# Altium project ETR_CELLMETER_SLAVE.PrjPcb (part 3 of 3)

## Sheet Charge.SchDoc
size A4
Used 2 times, as channels CH2, CH1. Parts and nets are listed once, with the designators drawn on the sheet.
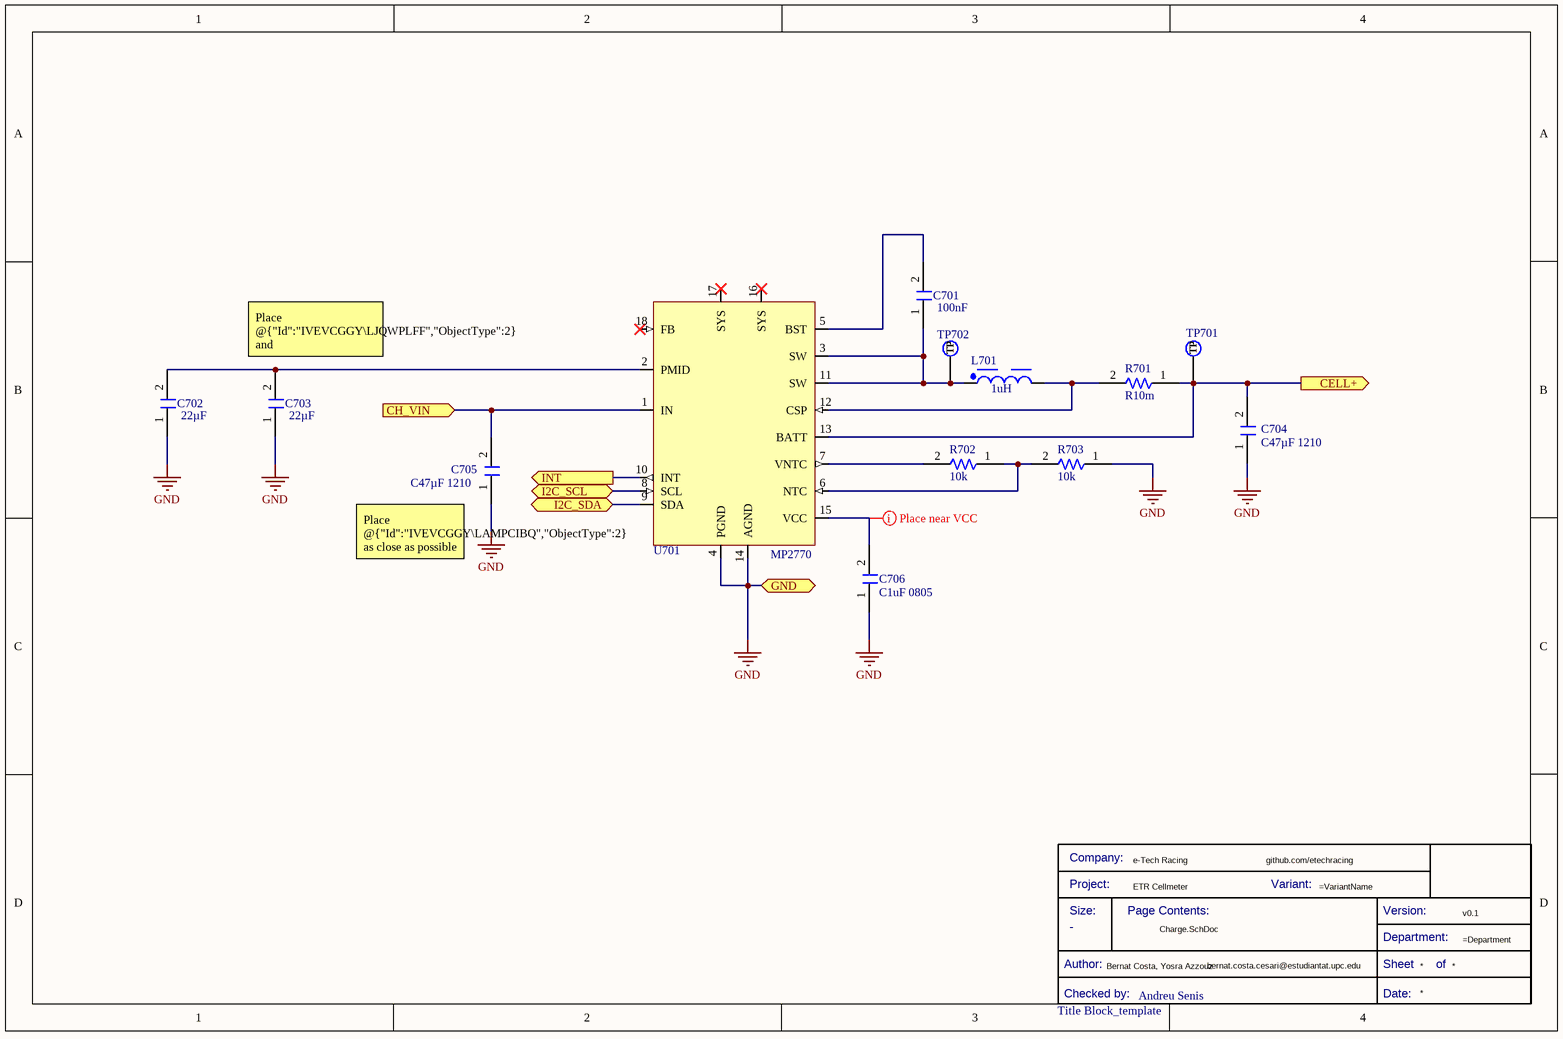
[diagram p8: Charge.SchDoc]

### Parts
*  Title Block_template  Checked by:: Andreu Senis  (graphical)
C701  value 100nF  [CAPC1608X92X38LL15T08]  (hidden comment: C100nF-25V-0603)
C702  value 22µF  [WCAP-CSGP_0805_L2W1.25H0.8_Reflow]  (hidden comment: C22uF-25V-0805)
C703  value 22µF  [WCAP-CSGP_0805_L2W1.25H0.8_Reflow]  (hidden comment: C22uF-25V-0805)
C704  C47µF 1210  [FP-GRM32E-0_3-0_2-IPC_C]
C705  C47µF 1210  [FP-GRM32E-0_3-0_2-IPC_C]
C706  C1uF 0805  [WCAP-CSGP_0805_L2W1.25H1.25]
L701  value 1uH  [WE-PD_7345]  (hidden comment: L1uH_120V_8A)
R701  value R10m  [WRIS-RSKS_1206_Wave]  (hidden comment: R10m-1206)
R702  value 10k  [R0805FTK]  (hidden comment: R10k-0805FTK)
R703  value 10k  [R0805FTK]  (hidden comment: R10k-0805FTK)
TP701  TestPoint  [TestPoint]  (value not drawn)  (no BOM)
TP702  TestPoint  [TestPoint]  (value not drawn)  (no BOM)
U701  MP2770  [MP2770]

### Ports
CELL+ (out), CH_VIN (in), GND (bidir), I2C_SCL (bidir), I2C_SDA (bidir), INT (out)

### Nets
GND: C702.1 C703.1 C704.1 C705.1 C706.1 R703.1 U701.4(PGND) U701.14(AGND) ; port GND
CELL+: C704.2 R701.1 TP701.1(TP) U701.13(BATT) ; port CELL+
CH_VIN: C705.2 U701.1(IN) ; port CH_VIN
I2C_SCL: U701.8(SCL) ; port I2C_SCL
I2C_SDA: U701.9(SDA) ; port I2C_SDA
INT: U701.10(INT) ; port INT
NetC701_1: C701.1 L701.1 TP702.1(TP) U701.3(SW) U701.11(SW)
NetC701_2: C701.2 U701.5(BST)
NetC702_2: C702.2 C703.2 U701.2(PMID)
NetC706_2: C706.2 U701.15(VCC)
NetL701_2: L701.2 R701.2 U701.12(CSP)
NetR702_1: R702.1 R703.2 U701.6(NTC)
NetR702_2: R702.2 U701.7(VNTC)

Not connected (* = marked no-connect by the designer): U701 16(SYS)* 17(SYS)* 18(FB)*

### Channels
CH2: designators end in _CH2; ports CELL+=NetC704_CH2_2 CH_VIN=+12V GND=GND I2C_SCL=I2C2_SCL I2C_SDA=I2C2_SDA INT=CH2_INT
CH1: designators end in _CH1; ports CELL+=NetC704_CH1_2 CH_VIN=+12V GND=GND I2C_SCL=I2C1_SCL I2C_SDA=I2C1_SDA INT=CH1_INT

### Layout directives
mark named Place near VCC: NetC706_CH2_2

### Notes on the sheet
- (near C703) Place @{"Id":"IVEVCGGY\LJQWPLFF","ObjectType":2} and @{"Id":"IVEVCGGY\PTQDCIFI","ObjectType":2} as close as possible to the IC
- (near C705) Place @{"Id":"IVEVCGGY\LAMPCIBQ","ObjectType":2} as close as possible to the IC
- (in symbol CMP-00043-7) Company:; Project:; Variant:; Size:; Page Contents:; Version:; Department:; Author:; Sheet; of; Checked by:; Date:

### Library data of the parts
* = CMP-00043-7: Standard Title Block; .Creator: GP; Size: -; Design Item ID: Title Block_template; Category: Title Block; .SCHcheck: GP; Source: e-Tech_Racing.SchLib; .PCBcheck: GP
C701 = CMP-001-00026-1: Ceramic Capacitor, Multilayer, Ceramic, 25V, 5% +Tol, 5% -Tol, X7R, 15% TC, 0.1uF, Surface Mount, 0603. PN: VJ0603Y104JXXAC.; Capacitor Type: Ceramic; RoHS Compliant: Yes; Pins: 2; Max Operating Temperature: 125°C; Min Operating Temperature: -55°C; Case/Package: 0603; Mounting Technology: Surface Mount
C702 C703 = CMP-001-00029-1: Ceramic Capacitor, Multilayer, Ceramic, 25V, 20% +Tol, 20% -Tol, X5R, 15% TC, 22uF, Surface Mount, 0805. PN: C2012X5R1E226M125AC.; Case/Package: 0805; Mounting Technology: Surface Mount; Min Operating Temperature: -55°C; Capacitor Type: Ceramic; Pins: 2; RoHS Compliant: Yes; Max Operating Temperature: 85°C
C704 C705 = CMP-001-00003-4: Ceramic Capacitor, Multilayer, Ceramic, 10V, 10% +Tol, 10% -Tol, X6S, 22% TC, 47uF, Surface Mount, 1210; Value: 47µF; Capacitor Type: Ceramic; Min Operating Temperature: -55°C; Pins: 2; RoHS Compliant: Yes; Case/Package: 1210; Max Operating Temperature: 105°C; Mounting Technology: Surface Mount
C706 = CMP-001-00010-5: Ceramic Capacitor, Multilayer, Ceramic, 16V, 10% +Tol, 10% -Tol, X7R, 15% TC, 1uF, Surface Mount, 0805; Capacitor Type: Ceramic; Pins: 2; RoHS Compliant: Yes
L701 = CMP-006-00008-1: General Purpose Inductor, 1uH, 40%, 1 Element, Ferrite-Core, SMD, 2929. PN: 744777001; Max Current Rating: 8A; Self Resonant Frequency: 90MHz; Tolerance: 40%; Max Operating Temperature: 125°C; Min Operating Temperature: -40°C; RoHS Compliant: Yes; Pins: 2
R701 = CMP-009-00047-1: Fixed Resistor, Metal Strip, 0.25W, 0.01ohm, 0.05V, 1% +/-Tol, 75ppm/Cel, Surface Mount, 1206. PN: WSL1206R0100FEK; Power: 250mW; Pins: 2; Case/Package: 1206; RoHS Compliant: Yes; Min Operating Temperature: -65°C; Tolerance: 1%; Max Operating Temperature: 170°C; Mounting Technology: Surface Mount
R702 R703 = CMP-00085-4: BOURNS         CR0805-JW-103ELF            Surface Mount Chip Resistor, Thick Film, CR Series, 10 kohm, 125 mW,  5%, 150 V; Voltage Rating: 150V; Voltage Rating (DC): 100V; Max Power Dissipation: 125mW; Temperature Coefficient: 200ppm/°C; .Creator: DR; Depth: 1.25mm; Package Quantity: 1; ComponentLink6Description: https://datasheet.ciiva.com/16783/70154685-16783482.pdf?src-supplier=Allied+Electronics; Max Operating Temperature: 155°C; ComponentLink8Description: https://datasheet.ciiva.com/6559/chpreztr-6559900.pdf?src-supplier=Digi-Key; ComponentLink3URL: https://datasheet.ciiva.com/22693/1902866-22693254.pdf?src-supplier=Element14; ComponentLink2URL: https://datasheet.ciiva.com/9122/chpreztr-9122374.pdf?src-supplier=Avnet; REACH SVHC: No SVHC; ComponentLink9Description: https://datasheet.ciiva.com/6559/chpreztr-6559901.pdf?src-supplier=Digi-Key; ComponentLink1URL: https://datasheet.ciiva.com/11821/0900766b80fcdb72-11821135.pdf?src-supplier=RSComponents; Manufacturer Part Number 1: CR0805-JW-103ELF; ComponentLink8URL: https://datasheet.ciiva.com/6559/chpreztr-6559900.pdf?src-supplier=Digi-Key; Length: 2mm; ComponentLink10Description: https://datasheet.ciiva.com/7985/1856384-7985869.pdf?src-supplier=Element14; Case/Package: 0805; ComponentLink5Description: https://datasheet.ciiva.com/30065/159chpreztr-30065976.pdf?src-supplier=Onlinecomponents.com; Design Item ID: R10k-0805FTK; ComponentLink1Description: https://datasheet.ciiva.com/11821/0900766b80fcdb72-11821135.pdf?src-supplier=RSComponents; Number of Terminations: 2; Radiation Hardening: No; Resistance Tolerance: 5%; ComponentLink4Description: https://datasheet.ciiva.com/7986/691949-7986187.pdf?src-supplier=Element14; ComponentLink3Description: https://datasheet.ciiva.com/22693/1902866-22693254.pdf?src-supplier=Element14; Packaging: Tape and Reel; ComponentLink6URL: https://datasheet.ciiva.com/16783/70154685-16783482.pdf?src-supplier=Allied+Electronics; Pins: 2; ComponentLink5URL: https://datasheet.ciiva.com/30065/159chpreztr-30065976.pdf?src-supplier=Onlinecomponents.com; Mount: Surface Mount; ComponentLink11URL: https://datasheet.ciiva.com/48692/001055517-da-01-en-smd-wid-cr0805-jw-103elf-10k-ohm-1-8w-48692118.pdf?src-supplier=Conrad; ComponentLink11Description: https://datasheet.ciiva.com/48692/001055517-da-01-en-smd-wid-cr0805-jw-103elf-10k-ohm-1-8w-48692118.pdf?src-supplier=Conrad; Military Standard: Not; Power Rating: 125mW; Thickness: 508um; Source: Passives.SchLib; Min Operating Temperature: -55°C; Manufacturer 1: Bourns; Resistor Type: Thick Film; ComponentLink7URL: https://datasheet.ciiva.com/5548/chpreztr-5548491.pdf?src-supplier=Mouser; ComponentLink2Description: https://datasheet.ciiva.com/9122/chpreztr-9122374.pdf?src-supplier=Avnet; Termination: SMD/SMT; Features: Moisture Resistant; ComponentLink4URL: https://datasheet.ciiva.com/7986/691949-7986187.pdf?src-supplier=Element14; RoHS Compliant: Yes; ComponentLink9URL: https://datasheet.ciiva.com/6559/chpreztr-6559901.pdf?src-supplier=Digi-Key; Technology: THICK FILM; ComponentLink10URL: https://datasheet.ciiva.com/7985/1856384-7985869.pdf?src-supplier=Element14; Height: 0.5mm; Category: Chip SMD Resistors; RoHS: Yes; Series: CR0805; Pricing 1: 1=0,05790, 10=0,01540, 25=0,01340, 100=0,00340 (USD); Stock 1: 57566; ComponentLink7Description: https://datasheet.ciiva.com/5548/chpreztr-5548491.pdf?src-supplier=Mouser; Case Code (Metric): 2012; Contact Plating: Tin; Tolerance: 5%; Construction: Rectangular; Width: 1.25mm
TP701 TP702 = CMP-00042-1: Test Point 1x1 mm; .SCHcheck: GP; Category: TestPoint; Source: e-Tech_Racing.SchLib; .Creator: GP; .PCBcheck: GP; Design Item ID: TestPoint
U701 = CMP-00029-00002-7: 6A, 1-Cell Switching Charger with Power Path Management and 3.65A Boost Output; ComponentLink1Description: Datasheet; ComponentLink1URL: https://www.monolithicpower.com/en/documentview/productdocument/index/version/2/document_type/Datasheet/lang/en/sku/MP2770GL/document_id/10545/

## Sheet NTC.SchDoc
size A4
Used 4 times, as channels NTC1, NTC2, NTC4, NTC3. Parts and nets are listed once, with the designators drawn on the sheet.
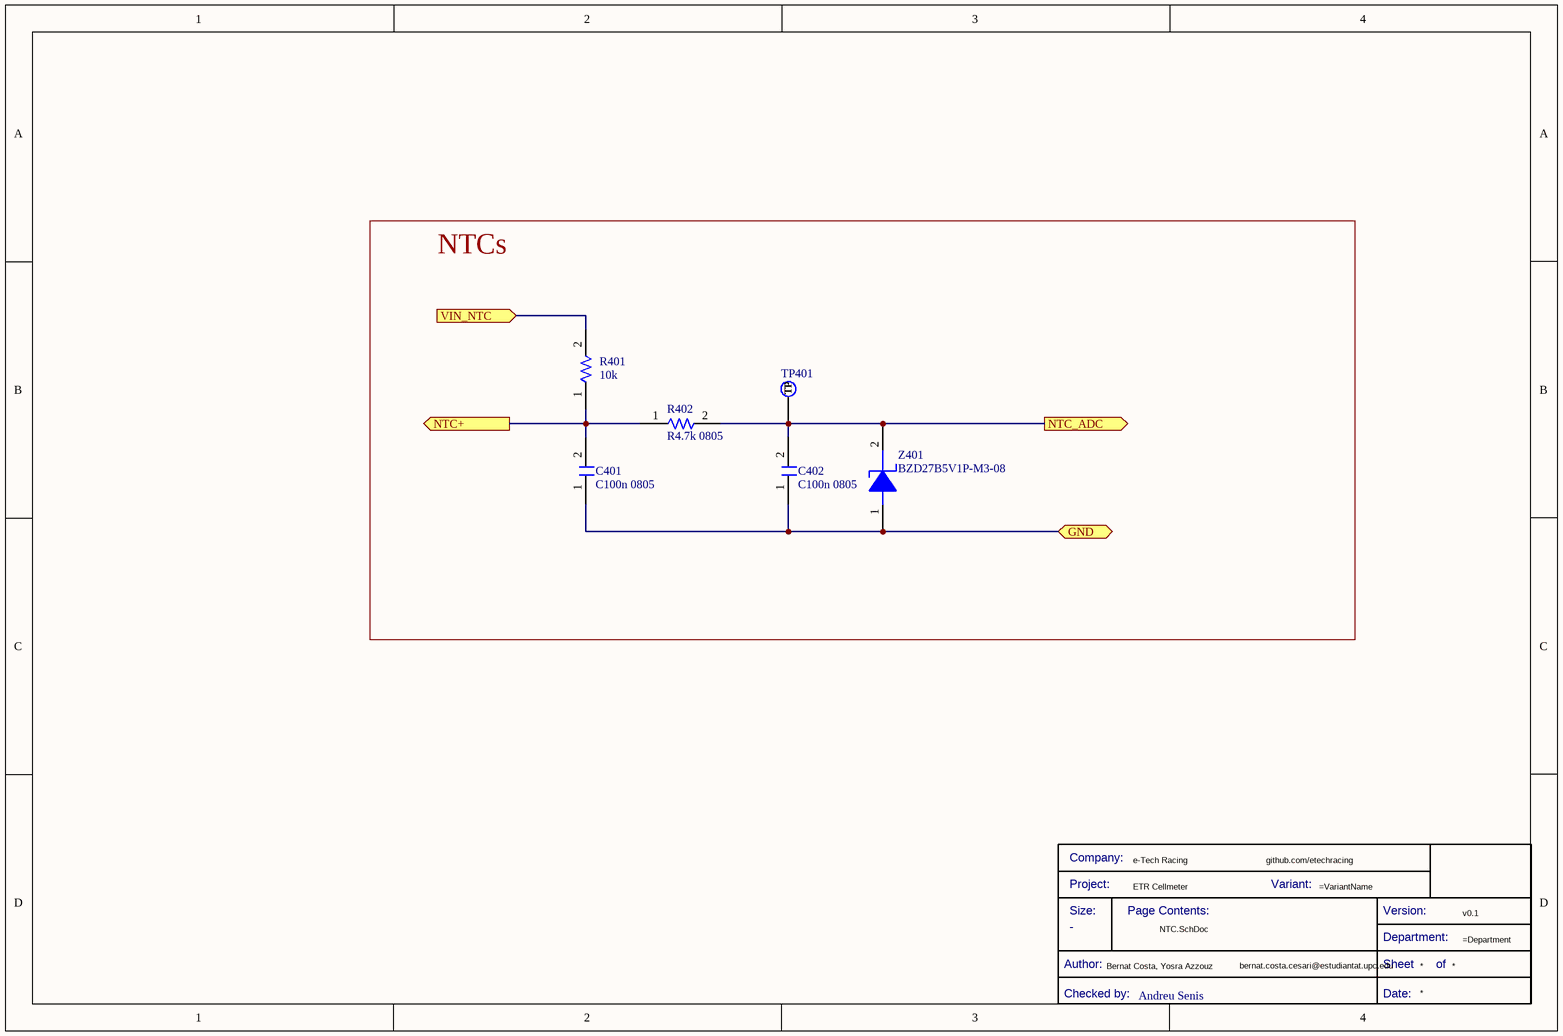
[diagram p9: NTC.SchDoc]

### Parts
*  Checked by:: Andreu Senis  (hidden comment: Title Block_template)  (graphical)
C401  C100n 0805  [C0805FNPC-R]
C402  C100n 0805  [C0805FNPC-R]
R401  value 10k  [R0805FTK]  (hidden comment: R10k-0805FTK)
R402  R4.7k 0805  [R0805FTK]
TP401  TestPoint  [TestPoint]  (value not drawn)  (no BOM)
Z401  BZD27B5V1P-M3-08  [SODFL370X108-2N]

### Blocks framed on the sheet
NTCs: C401 C402 R401 R402 TP401 Z401

### Ports
GND (bidir), NTC+ (out), NTC_ADC (out), VIN_NTC (in)

### Nets
GND: C401.1 C402.1 Z401.1 ; port GND
NTC+: C401.2 R401.1 R402.1 ; port NTC+
NTC_ADC: C402.2 R402.2 TP401.1(TP) Z401.2 ; port NTC_ADC
VIN_NTC: R401.2 ; port VIN_NTC

### Channels
NTC1: designators end in _NTC1; ports GND=GND NTC+=NTC2+ NTC_ADC=NetC402_NTC1_2 VIN_NTC=+5V
NTC2: designators end in _NTC2; ports GND=GND NTC+=NTC1+ NTC_ADC=NetC402_NTC2_2 VIN_NTC=+5V
NTC4: designators end in _NTC4; ports GND=GND NTC+=NetC401_NTC4_2 NTC_ADC=DCH_NTC2_ADC VIN_NTC=+5V
NTC3: designators end in _NTC3; ports GND=GND NTC+=NetC401_NTC3_2 NTC_ADC=DCH_NTC1_ADC VIN_NTC=+5V

### Notes on the sheet
- (in symbol Title Block_template) Company:; Project:; Variant:; Size:; Page Contents:; Version:; Department:; Author:; Sheet; of; Checked by:; Date:

### Library data of the parts
* = Title Block_template: Standard Title Block; .Creator: GP; Category: Title Block; .PCBcheck: GP; .SCHcheck: GP; Size: -
C401 C402 = CMP-00063-3: Cap, 0.1ΜF, 50V, 10%, X7R, 0805; Manufacturer Part Number 1: 885012207098; Manufacturer 1: Wurth Electronics; Value: 100nF; .Creator: DR; ComponentLink2Description: http://www.farnell.com/datasheets/1958498.pdf?src-supplier=Element14; ComponentLink1Description: http://www.farnell.com/datasheets/1958498.pdf?src-supplier=Farnell; Thickness: 0.035inch; ComponentLink1URL: http://www.farnell.com/datasheets/1958498.pdf?src-supplier=Farnell; Min Operating Temperature: -55°C; Packaging: Cut Tape; ComponentLink2URL: http://www.farnell.com/datasheets/1958498.pdf?src-supplier=Element14; Mount: Surface Mount; Voltage Rating (DC): 50V; Tolerance: 10%; Category: Ceramic Capacitors; RoHS: Yes; Width: 0.049inch; Pricing 1: 100=0,10200, 500=0,07100, 2000=0,06100 (GBP); RoHS Compliant: Yes; ComponentLink4Description: http://www.farnell.com/datasheets/1958498.pdf?src-supplier=Newark; Dielectric: X7R; Stock 1: 8000; Length: 0.079inch; ComponentLink3URL: https://katalog.we-online.de/pbs/datasheet/885012207098.pdf?src-supplier=Digi-Key; ComponentLink3Description: https://katalog.we-online.de/pbs/datasheet/885012207098.pdf?src-supplier=Digi-Key; Design Item ID: C100n-50V-0805FNPC-X7R; ComponentLink4URL: http://www.farnell.com/datasheets/1958498.pdf?src-supplier=Newark; REACH SVHC: Unknown; Case Code (Metric): 2012; Voltage Rating: 50V; Max Operating Temperature: 125°C; Source: Passives.SchLib; Case/Package: 0805
R401 = CMP-00085-3: BOURNS         CR0805-JW-103ELF            Surface Mount Chip Resistor, Thick Film, CR Series, 10 kohm, 125 mW,  5%, 150 V; Voltage Rating: 150V; Max Power Dissipation: 125mW; .Creator: DR; Temperature Coefficient: 200ppm/°C; Voltage Rating (DC): 100V; ComponentLink8Description: https://datasheet.ciiva.com/6559/chpreztr-6559900.pdf?src-supplier=Digi-Key; Depth: 1.25mm; ComponentLink4URL: https://datasheet.ciiva.com/7986/691949-7986187.pdf?src-supplier=Element14; RoHS Compliant: Yes; ComponentLink5Description: https://datasheet.ciiva.com/30065/159chpreztr-30065976.pdf?src-supplier=Onlinecomponents.com; Height: 0.5mm; ComponentLink9URL: https://datasheet.ciiva.com/6559/chpreztr-6559901.pdf?src-supplier=Digi-Key; REACH SVHC: No SVHC; ComponentLink2Description: https://datasheet.ciiva.com/9122/chpreztr-9122374.pdf?src-supplier=Avnet; ComponentLink1URL: https://datasheet.ciiva.com/11821/0900766b80fcdb72-11821135.pdf?src-supplier=RSComponents; ComponentLink7Description: https://datasheet.ciiva.com/5548/chpreztr-5548491.pdf?src-supplier=Mouser; Termination: SMD/SMT; RoHS: Yes; Length: 2mm; Pins: 2; Radiation Hardening: No; Thickness: 508um; Width: 1.25mm; Pricing 1: 1=0,05790, 10=0,01540, 25=0,01340, 100=0,00340 (USD); Resistor Type: Thick Film; Stock 1: 57566; Package Quantity: 1; ComponentLink4Description: https://datasheet.ciiva.com/7986/691949-7986187.pdf?src-supplier=Element14; ComponentLink5URL: https://datasheet.ciiva.com/30065/159chpreztr-30065976.pdf?src-supplier=Onlinecomponents.com; Mount: Surface Mount; Resistance Tolerance: 5%; Tolerance: 5%; Construction: Rectangular; ComponentLink11Description: https://datasheet.ciiva.com/48692/001055517-da-01-en-smd-wid-cr0805-jw-103elf-10k-ohm-1-8w-48692118.pdf?src-supplier=Conrad; ComponentLink6Description: https://datasheet.ciiva.com/16783/70154685-16783482.pdf?src-supplier=Allied+Electronics; ComponentLink10URL: https://datasheet.ciiva.com/7985/1856384-7985869.pdf?src-supplier=Element14; Case Code (Metric): 2012; Technology: THICK FILM; ComponentLink3Description: https://datasheet.ciiva.com/22693/1902866-22693254.pdf?src-supplier=Element14; Min Operating Temperature: -55°C; Manufacturer 1: Bourns; ComponentLink2URL: https://datasheet.ciiva.com/9122/chpreztr-9122374.pdf?src-supplier=Avnet; Military Standard: Not; Features: Moisture Resistant; ComponentLink7URL: https://datasheet.ciiva.com/5548/chpreztr-5548491.pdf?src-supplier=Mouser; Design Item ID: R10k-0805FTK; ComponentLink9Description: https://datasheet.ciiva.com/6559/chpreztr-6559901.pdf?src-supplier=Digi-Key; Power Rating: 125mW; ComponentLink11URL: https://datasheet.ciiva.com/48692/001055517-da-01-en-smd-wid-cr0805-jw-103elf-10k-ohm-1-8w-48692118.pdf?src-supplier=Conrad; ComponentLink8URL: https://datasheet.ciiva.com/6559/chpreztr-6559900.pdf?src-supplier=Digi-Key; Contact Plating: Tin; ComponentLink10Description: https://datasheet.ciiva.com/7985/1856384-7985869.pdf?src-supplier=Element14; Manufacturer Part Number 1: CR0805-JW-103ELF; Packaging: Tape and Reel; ComponentLink3URL: https://datasheet.ciiva.com/22693/1902866-22693254.pdf?src-supplier=Element14; ComponentLink6URL: https://datasheet.ciiva.com/16783/70154685-16783482.pdf?src-supplier=Allied+Electronics; ComponentLink1Description: https://datasheet.ciiva.com/11821/0900766b80fcdb72-11821135.pdf?src-supplier=RSComponents; Series: CR0805; Category: Chip SMD Resistors; Number of Terminations: 2; Max Operating Temperature: 155°C; Source: Passives.SchLib; Case/Package: 0805
R402 = CMP-00102-2: Res Thick Film 0805 4.7K Ohm 5% 1/8W ±200ppm/°C Molded SMD SMD Paper Tape on Plastic Reel; Manufacturer 1: Bourns; Manufacturer Part Number 1: CR0805-JW-472ELF; .Creator: DR; Voltage Rating: 150V; Power Rating: 125mW; ComponentLink5URL: https://datasheet.ciiva.com/9122/chpreztr-9122814.pdf?src-supplier=Avnet; Package Quantity: 1; Min Operating Temperature: -55°C; ComponentLink5Description: https://datasheet.ciiva.com/9122/chpreztr-9122814.pdf?src-supplier=Avnet; Case Code (Metric): 2012; Termination: SMD/SMT; Series: CR0805; Packaging: Tape and Reel; Value: 4.7k; ComponentLink3URL: https://datasheet.ciiva.com/6560/chpreztr-6560074.pdf?src-supplier=Digi-Key; Height: 0.024inch; Case/Package: 0805; Military Standard: Not; Depth: 1.25mm; Thickness: 508um; Contact Plating: Tin; Features: Moisture Resistant; Temperature Coefficient: 200ppm/°C; ComponentLink4URL: https://datasheet.ciiva.com/30174/159chpreztr-30174252.pdf?src-supplier=Onlinecomponents.com; RoHS: Yes; Stock 1: 3734; ComponentLink1URL: https://datasheet.ciiva.com/5541/chpreztr-5541593.pdf?src-supplier=Mouser; Design Item ID: R4.7K-0805FTK; ComponentLink7URL: https://datasheet.ciiva.com/6560/chpreztr-6560075.pdf?src-supplier=Digi-Key; Category: Chip SMD Resistors; Resistance Tolerance: 5%; Width: 0.049inch; ComponentLink2Description: https://datasheet.ciiva.com/6560/chpreztr-6560073.pdf?src-supplier=Digi-Key; Mount: Surface Mount; Pricing 1: 1=0,05590, 10=0,01670, 25=0,01290, 100=0,00840, 250=0,00830, 500=0,00690, 1000=0,00410 (USD); Resistor Type: Thick Film; REACH SVHC: No SVHC; Source: Passives.SchLib; ComponentLink2URL: https://datasheet.ciiva.com/6560/chpreztr-6560073.pdf?src-supplier=Digi-Key; Construction: Rectangular; Length: 2mm; ComponentLink7Description: https://datasheet.ciiva.com/6560/chpreztr-6560075.pdf?src-supplier=Digi-Key; Radiation Hardening: No; ComponentLink3Description: https://datasheet.ciiva.com/6560/chpreztr-6560074.pdf?src-supplier=Digi-Key; ComponentLink4Description: https://datasheet.ciiva.com/30174/159chpreztr-30174252.pdf?src-supplier=Onlinecomponents.com; ComponentLink1Description: https://datasheet.ciiva.com/5541/chpreztr-5541593.pdf?src-supplier=Mouser; ComponentLink6URL: https://datasheet.ciiva.com/22713/691949-22713272.pdf?src-supplier=Element14; RoHS Compliant: Yes; Max Operating Temperature: 155°C; Voltage Rating (DC): 150V; Tolerance: 5%; Number of Terminations: 2; Max Power Dissipation: 125mW; ComponentLink6Description: https://datasheet.ciiva.com/22713/691949-22713272.pdf?src-supplier=Element14
TP401 = CMP-00042-1: Test Point 1x1 mm; .SCHcheck: GP; Category: TestPoint; Source: e-Tech_Racing.SchLib; .Creator: GP; .PCBcheck: GP; Design Item ID: TestPoint
Z401 = CMP-004-00008-1: Zener Diode, 5.1V V(Z), 2%, 0.8W, Silicon, Unidirectional, DO-219AB; RoHS Compliant: Yes; Pins: 2; Max Operating Temperature: 175°C; Min Operating Temperature: -65°C

## Nets that join several sheets
+3.3V: ETR_CELLMETER_SLAVE (J7.1), Level_Shifter (C201.2 U201.1), CAN (C605#1.2 U601#1.5), MCU (13 pins), Supply (5 pins), DCH1 (C801_DCH1.1 R801_DCH1.2 U801_DCH1.8), DCH2 (C801_DCH2.1 R801_DCH2.2 U801_DCH2.8)
+5V: ADC (C105.2 L101.1), Level_Shifter (C202.2 U201.20), CAN (C601#1.2 C602#1.2 U601#1.3), Supply (8 pins), KCELL1 (D301_KCELL1.K D302_KCELL1.K K301_KCELL1.A2 K302_KCELL1.A2), KCELL2 (D301_KCELL2.K D302_KCELL2.K K301_KCELL2.A2 K302_KCELL2.A2), NTC1 (R401_NTC1.2), NTC2 (R401_NTC2.2), NTC4 (R401_NTC4.2), NTC3 (R401_NTC3.2)
+12V: ETR_CELLMETER_SLAVE (J8.1), Supply (7 pins), DCH1 (C803_DCH1.2 U802_DCH1.8), DCH2 (C803_DCH2.2 U802_DCH2.8), CH2 (C705_CH2.2 U701_CH2.1), CH1 (C705_CH1.2 U701_CH1.1)
GND: ETR_CELLMETER_SLAVE (12 pins), ADC (12 pins), Level_Shifter (C201.1 C202.1 U201.10 U201.11), CAN (12 pins), MCU (26 pins), Supply (16 pins), KCELL1 (Q301_KCELL1.S Q302_KCELL1.S R302_KCELL1.1 R304_KCELL1.1), KCELL2 (Q301_KCELL2.S Q302_KCELL2.S R302_KCELL2.1 R304_KCELL2.1), DCH1 (10 pins), DCH2 (10 pins), CH2 (8 pins), CH1 (8 pins), NTC1 (C401_NTC1.1 C402_NTC1.1 Z401_NTC1.1), NTC2 (C401_NTC2.1 C402_NTC2.1 Z401_NTC2.1), NTC4 (C401_NTC4.1 C402_NTC4.1 Z401_NTC4.1), NTC3 (C401_NTC3.1 C402_NTC3.1 Z401_NTC3.1)
CAN1_H: ETR_CELLMETER_SLAVE (J3.1 J3.2), CAN (C604#1.2 D601#1.2 L601#1.2 R601#1.2)
CAN1_L: ETR_CELLMETER_SLAVE (J4.1 J4.2), CAN (C608#1.1 D602#1.1 L601#1.3 R602#1.1)
CELL1+: ETR_CELLMETER_SLAVE (D1.2 J9.1), KCELL1 (K302_KCELL1.11)
CELL1_LED1: ETR_CELLMETER_SLAVE (J1.3), MCU (U601#2.85)
CELL1_LED2: ETR_CELLMETER_SLAVE (J1.4), MCU (U601#2.84)
CELL2+: ETR_CELLMETER_SLAVE (D2.2 J10.1), KCELL2 (K302_KCELL2.11)
CELL2_LED1: ETR_CELLMETER_SLAVE (J2.3), MCU (U601#2.24)
CELL2_LED2: ETR_CELLMETER_SLAVE (J2.4), MCU (U601#2.25)
CH1_INT: MCU (U601#2.81), CH1 (U701_CH1.10)
CH2_INT: MCU (U601#2.7), CH2 (U701_CH2.10)
DAC_OUT1: MCU (U601#2.29), DCH1 (U802_DCH1.5)
DAC_OUT2: MCU (U601#2.30), DCH2 (U802_DCH2.5)
DCH_NTC1_ADC: MCU (U601#2.35), NTC3 (C402_NTC3.2 R402_NTC3.2 TP401_NTC3.1 Z401_NTC3.2)
DCH_NTC2_ADC: MCU (U601#2.36), NTC4 (C402_NTC4.2 R402_NTC4.2 TP401_NTC4.1 Z401_NTC4.2)
I2C1_SCL: MCU (U601#2.92), CH1 (U701_CH1.8)
I2C1_SDA: MCU (U601#2.93), CH1 (U701_CH1.9)
I2C2_SCL: MCU (U601#2.47), CH2 (U701_CH2.8)
I2C2_SDA: MCU (U601#2.48), CH2 (U701_CH2.9)
MCU_ADC_S1: MCU (U601#2.34), DCH1 (U801_DCH1.7)
MCU_ADC_S2: MCU (U601#2.16), DCH2 (U801_DCH2.7)
NetC401_NTC3_2: DCH1 (NTC801_DCH1.1), NTC3 (C401_NTC3.2 R401_NTC3.1 R402_NTC3.1)
NetC401_NTC4_2: DCH2 (NTC801_DCH2.1), NTC4 (C401_NTC4.2 R401_NTC4.1 R402_NTC4.1)
NetC402_NTC1_2: MCU (U601#2.17), NTC1 (C402_NTC1.2 R402_NTC1.2 TP401_NTC1.1 Z401_NTC1.2)
NetC402_NTC2_2: MCU (U601#2.18), NTC2 (C402_NTC2.2 R402_NTC2.2 TP401_NTC2.1 Z401_NTC2.2)
NetC704_CH1_2: KCELL1 (K301_KCELL1.12), CH1 (C704_CH1.2 R701_CH1.1 TP701_CH1.1 U701_CH1.13)
NetC704_CH2_2: KCELL2 (K301_KCELL2.12), CH2 (C704_CH2.2 R701_CH2.1 TP701_CH2.1 U701_CH2.13)
NetK301_KCELL1_14: KCELL1 (K301_KCELL1.14), DCH1 (U801_DCH1.1 U801_DCH1.2)
NetK301_KCELL2_14: KCELL2 (K301_KCELL2.14), DCH2 (U801_DCH2.1 U801_DCH2.2)
NetR301_KCELL1_1: MCU (U601#2.60), KCELL1 (R301_KCELL1.1 R302_KCELL1.2)
NetR301_KCELL2_1: MCU (U601#2.2), KCELL2 (R301_KCELL2.1 R302_KCELL2.2)
NetR303_KCELL1_1: MCU (U601#2.59), KCELL1 (R303_KCELL1.1 R304_KCELL1.2)
NetR303_KCELL2_1: MCU (U601#2.3), KCELL2 (R303_KCELL2.1 R304_KCELL2.2)
NetU101_8: ADC (U101.8), Level_Shifter (U201.5)
NetU101_9: ADC (U101.9), Level_Shifter (U201.3)
NetU101_10: ADC (U101.10), Level_Shifter (U201.19)
NetU101_11: ADC (U101.11), Level_Shifter (U201.15)
NetU201_2: Level_Shifter (U201.2), MCU (U601#2.90)
NetU201_6: Level_Shifter (U201.6), MCU (U601#2.89)
NetU201_16: Level_Shifter (U201.16), MCU (U601#2.77)
NetU201_18: Level_Shifter (U201.18), MCU (U601#2.91)
NetU601#1_1: CAN (U601#1.1), MCU (U601#2.70)
NetU601#1_4: CAN (U601#1.4), MCU (U601#2.71)
NRST: ETR_CELLMETER_SLAVE (J7.5), MCU (U601#2.14)
NTC1+: ETR_CELLMETER_SLAVE (J1.1), NTC2 (C401_NTC2.2 R401_NTC2.1 R402_NTC2.1)
NTC2+: ETR_CELLMETER_SLAVE (J2.1), NTC1 (C401_NTC1.2 R401_NTC1.1 R402_NTC1.1)
S_CELL1+: ETR_CELLMETER_SLAVE (J5.2), ADC (R101.2)
S_CELL1-: ETR_CELLMETER_SLAVE (J5.1), ADC (R102.2)
S_CELL2+: ETR_CELLMETER_SLAVE (J6.2), ADC (R103.2)
S_CELL2-: ETR_CELLMETER_SLAVE (J6.1), ADC (R104.2)
SWCLK: ETR_CELLMETER_SLAVE (J7.2), MCU (U601#2.76)
SWDIO: ETR_CELLMETER_SLAVE (J7.4), MCU (U601#2.72)